# Altium schematic sheet Sheet1.SchDoc
size A4
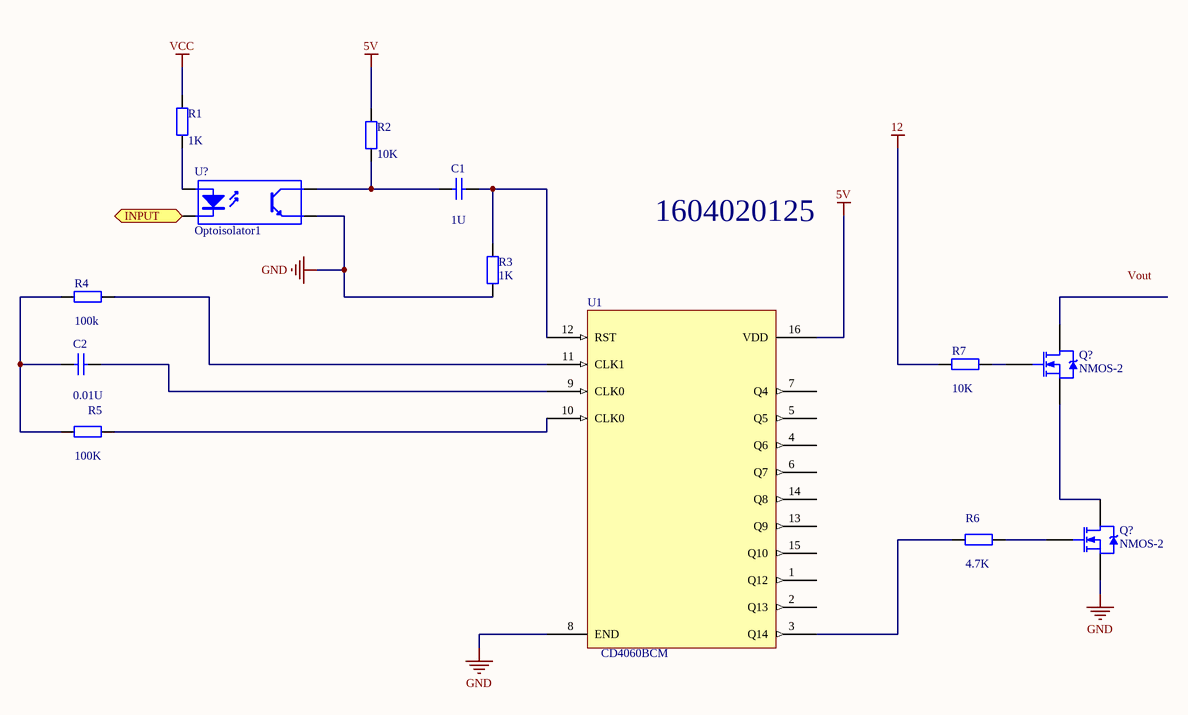
[diagram p0: Sheet1.SchDoc]

## Parts
(Parts that share a designator on the sheet are numbered #1, #2 ... from top to bottom, then left to right.)
C1  value 1U  [RAD-0.3]  (hidden comment: Cap)
C2  value 0.01U  [RAD-0.3]  (hidden comment: Cap)
Q?#1  NMOS-2  [TO-220AB]
Q?#2  NMOS-2  [TO-220AB]
R1  value 1K  [AXIAL-0.4]  (hidden comment: Res2)
R2  value 10K  [AXIAL-0.4]  (hidden comment: Res2)
R3  value 1K  [AXIAL-0.4]  (hidden comment: Res2)
R4  value 100k  [AXIAL-0.4]  (hidden comment: Res2)
R5  value 100K  [AXIAL-0.4]  (hidden comment: Res2)
R6  value 4.7K  [AXIAL-0.4]  (hidden comment: Res2)
R7  value 10K  [AXIAL-0.4]  (hidden comment: Res2)
U1  (no value)
U?  Optoisolator1  [DIP-4]

## Ports
INPUT

## Nets
5V: R2.2 U1.16(VDD)
12: R7.1
GND: Q?#2.3(S) R3.1 U1.8(END) U?.3(E)
VCC: R1.2
INPUT: U?.2(K) ; port INPUT
NetC1_1: C1.1 R2.1 U?.4(C)
NetC1_2: C1.2 R3.2 U1.12(RST)
NetC2_1: C2.1 R4.1 R5.1
NetC2_2: C2.2 U1.9(CLK0)
NetQ?#1_1: Q?#1.1(G) R7.2
NetQ?#1_3: Q?#1.3(S) Q?#2.2(D)
NetQ?#2_1: Q?#2.1(G) R6.2
NetR1_1: R1.1 U?.1(A)
NetR4_2: R4.2 U1.11(CLK1)
NetR5_2: R5.2 U1.10(CLK0)
NetR6_1: R6.1 U1.3(Q14)

Not connected (* = marked no-connect by the designer): Q?#1 2(D); U1 1(Q12) 2(Q13) 4(Q6) 5(Q5) 6(Q7) 7(Q4) 13(Q9) 14(Q8) 15(Q10)

## Notes on the sheet
- 1604020125
- Labels drawn without touching a wire or pin: Vout
- (in symbol Component_1) CD4060BCM

## Library data of the parts
C1 C2 = Cap: Capacitor; Published: 8-Jun-2000; LatestRevisionDate: 17-Jul-2002; LatestRevisionNote: Re-released for DXP Platform.; PackageReference: RAD-0.3; Publisher: Altium Limited; PackageDescription: Radial Cap, Thru-Hole; 2 Leads; 0.3 in Pin Spacing
Q?#1 Q?#2 = NMOS-2: N-Channel Power MOSFET; Note: Pin 2 is electrically connected to pin 4.; Published: 8-Jun-2000; LatestRevisionDate: 17-Jul-2002; LatestRevisionNote: Re-released for DXP Platform.; DatasheetVersion: PD-9.814; PackageVersion: Feb-1997; PackageReference: TO-220AB; Publisher: Altium Limited; PackageDescription: TO, Thru-Hole, Vertical, Heatsink Mounted; 3 In-Line Leads; Pitch 2.54 mm; ComponentLink1Description: Manufacturer Link; ComponentLink1URL: http://www.irf.com/
R1-R7 = Res2: Resistor; Published: 8-Jun-2000; LatestRevisionDate: 17-Jul-2002; LatestRevisionNote: Re-released for DXP Platform.; PackageReference: AXIAL-0.4; Publisher: Altium Limited; PackageDescription: Axial Device, Thru-Hole; 2 Leads; 0.4 in Pin Spacing
U1 = Component_1
U? = Optoisolator1: 4-Pin Phototransistor Optocoupler; Published: 24-Mar-1999; LatestRevisionDate: 04-Mar-2005; LatestRevisionNote: Sch pins 3 & 4 Swapped.; DatasheetVersion: Nov-2003; PackageReference: DIP-4; Publisher: Altium Limited